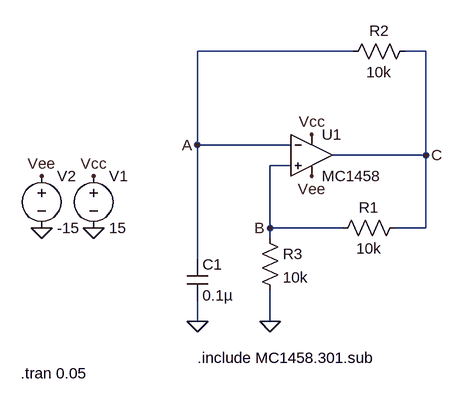
[diagram p0: schematic kadai1-6.asc]
kadai1-6.asc, the LTspice schematic file:
Version 4
SHEET 1 880 680
WIRE 512 -32 272 -32
WIRE 624 -32 592 -32
WIRE 272 112 272 -32
WIRE 416 112 272 112
WIRE 624 128 624 -32
WIRE 624 128 480 128
WIRE 416 144 384 144
WIRE 384 240 384 144
WIRE 496 240 384 240
WIRE 624 240 624 128
WIRE 624 240 576 240
WIRE 384 256 384 240
WIRE 272 288 272 112
WIRE 272 384 272 352
WIRE 384 384 384 336
FLAG 32 240 0
FLAG 112 240 0
FLAG 112 160 Vcc
FLAG 32 160 Vee
FLAG 448 96 Vcc
FLAG 448 160 Vee
FLAG 272 384 0
FLAG 384 384 0
FLAG 272 112 A
FLAG 624 128 C
FLAG 384 240 B
SYMBOL voltage 112 144 R0
SYMATTR InstName V1
SYMATTR Value 15
SYMBOL voltage 32 144 R0
SYMATTR InstName V2
SYMATTR Value -15
SYMBOL OpAmps\\opamp2 448 64 R0
SYMATTR InstName U1
SYMATTR Value MC1458
SYMBOL res 592 224 R90
WINDOW 0 0 56 VBottom 2
WINDOW 3 32 56 VTop 2
SYMATTR InstName R1
SYMATTR Value 10k
SYMBOL res 608 -48 R90
WINDOW 0 0 56 VBottom 2
WINDOW 3 32 56 VTop 2
SYMATTR InstName R2
SYMATTR Value 10k
SYMBOL cap 256 288 R0
SYMATTR InstName C1
SYMATTR Value 0.1µ
SYMBOL res 368 240 R0
SYMATTR InstName R3
SYMATTR Value 10k
TEXT 272 440 Left 2 !.include MC1458.301.sub
TEXT 0 464 Left 2 !.tran 0.05

The netlist it stands for:
* kadai1-6.asc
V1 Vcc 0 15
V2 Vee 0 -15
XU1 B A Vcc Vee C MC1458  ; pins In+ In- V+ V- OUT
R1 C B 10k
R2 C A 10k
C1 A 0 0.1µ
R3 B 0 10k
.include MC1458.301.sub
.tran 0.05
.backanno
.end

* Results of the author's LTspice run, read from the files saved beside the schematic
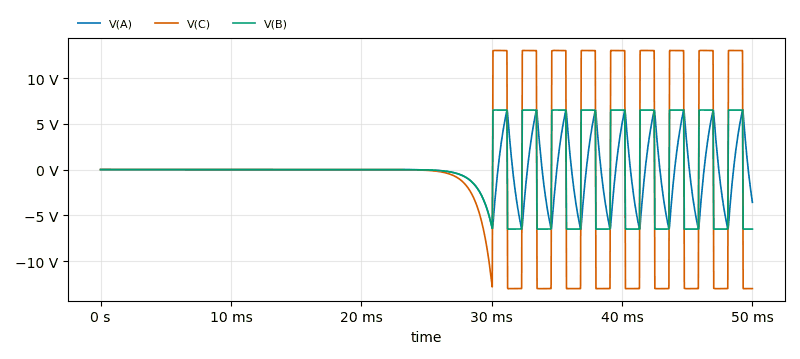
[diagram p1: Transient Analysis of kadai1-6.asc, plotted from the saved traces]
* Transient Analysis, 1 run:
*   V(A): min -6.531 V, max 6.528 V, average -91.49 mV, rms 2.601 V, last -3.579 V
*   V(C): min -13.02 V, max 13.02 V, average -162.2 mV, rms 8.202 V, last -13 V
*   V(B): min -6.512 V, max 6.51 V, average -81.49 mV, rms 4.101 V, last -6.502 V